# EasyEDA Pro project 闪光徽章.eprj

# Schematic Schematic1

## Sheets
1 LED字符: Board Name: Board1; Create Date: 2025-11-20; Page Name: LED字符; Project Name: 闪光徽章; Schematic Name: Schematic1; Update Date: 2025-11-20; Company: 嘉立创EDA; Page Size: A4; Version: V1.0
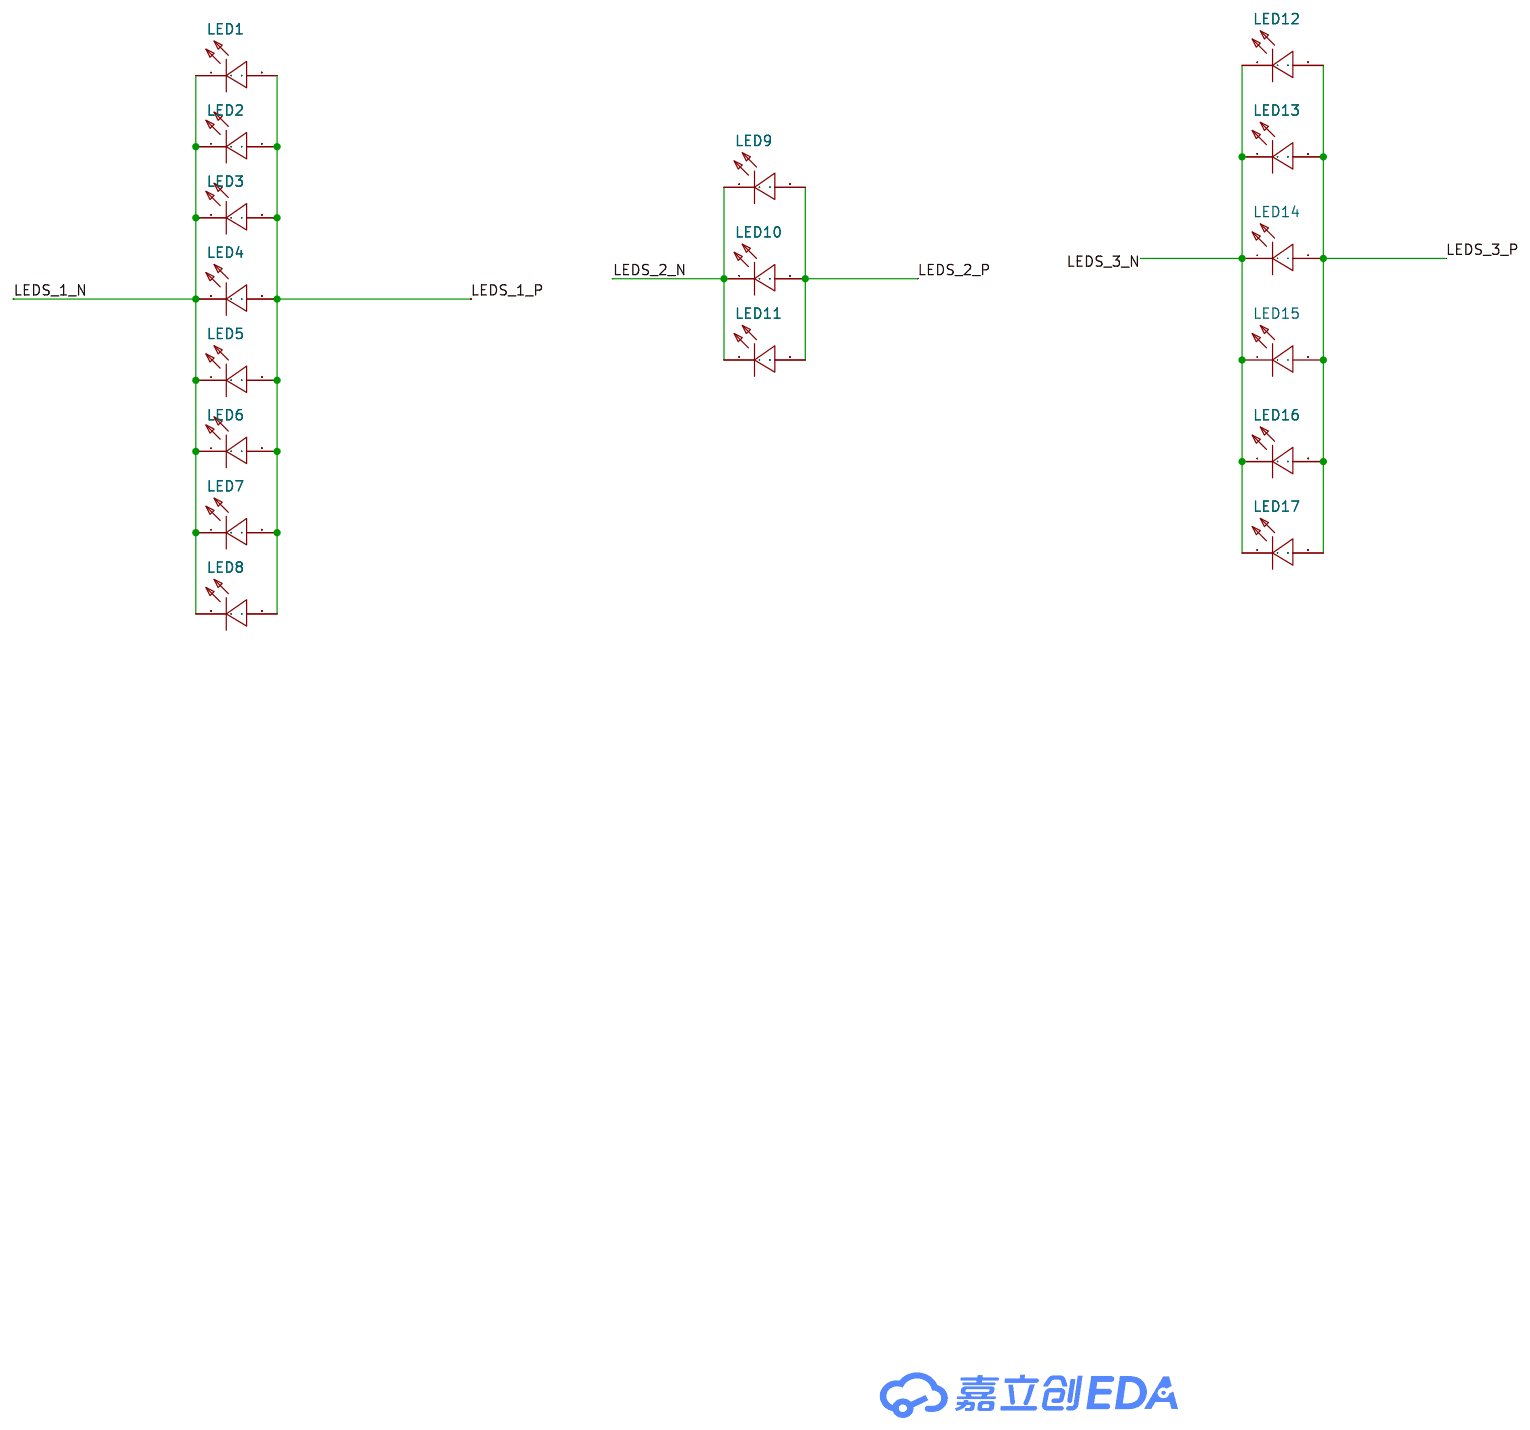
[diagram p0: LED字符]
2 三无稳振荡: Page Name: 三无稳振荡
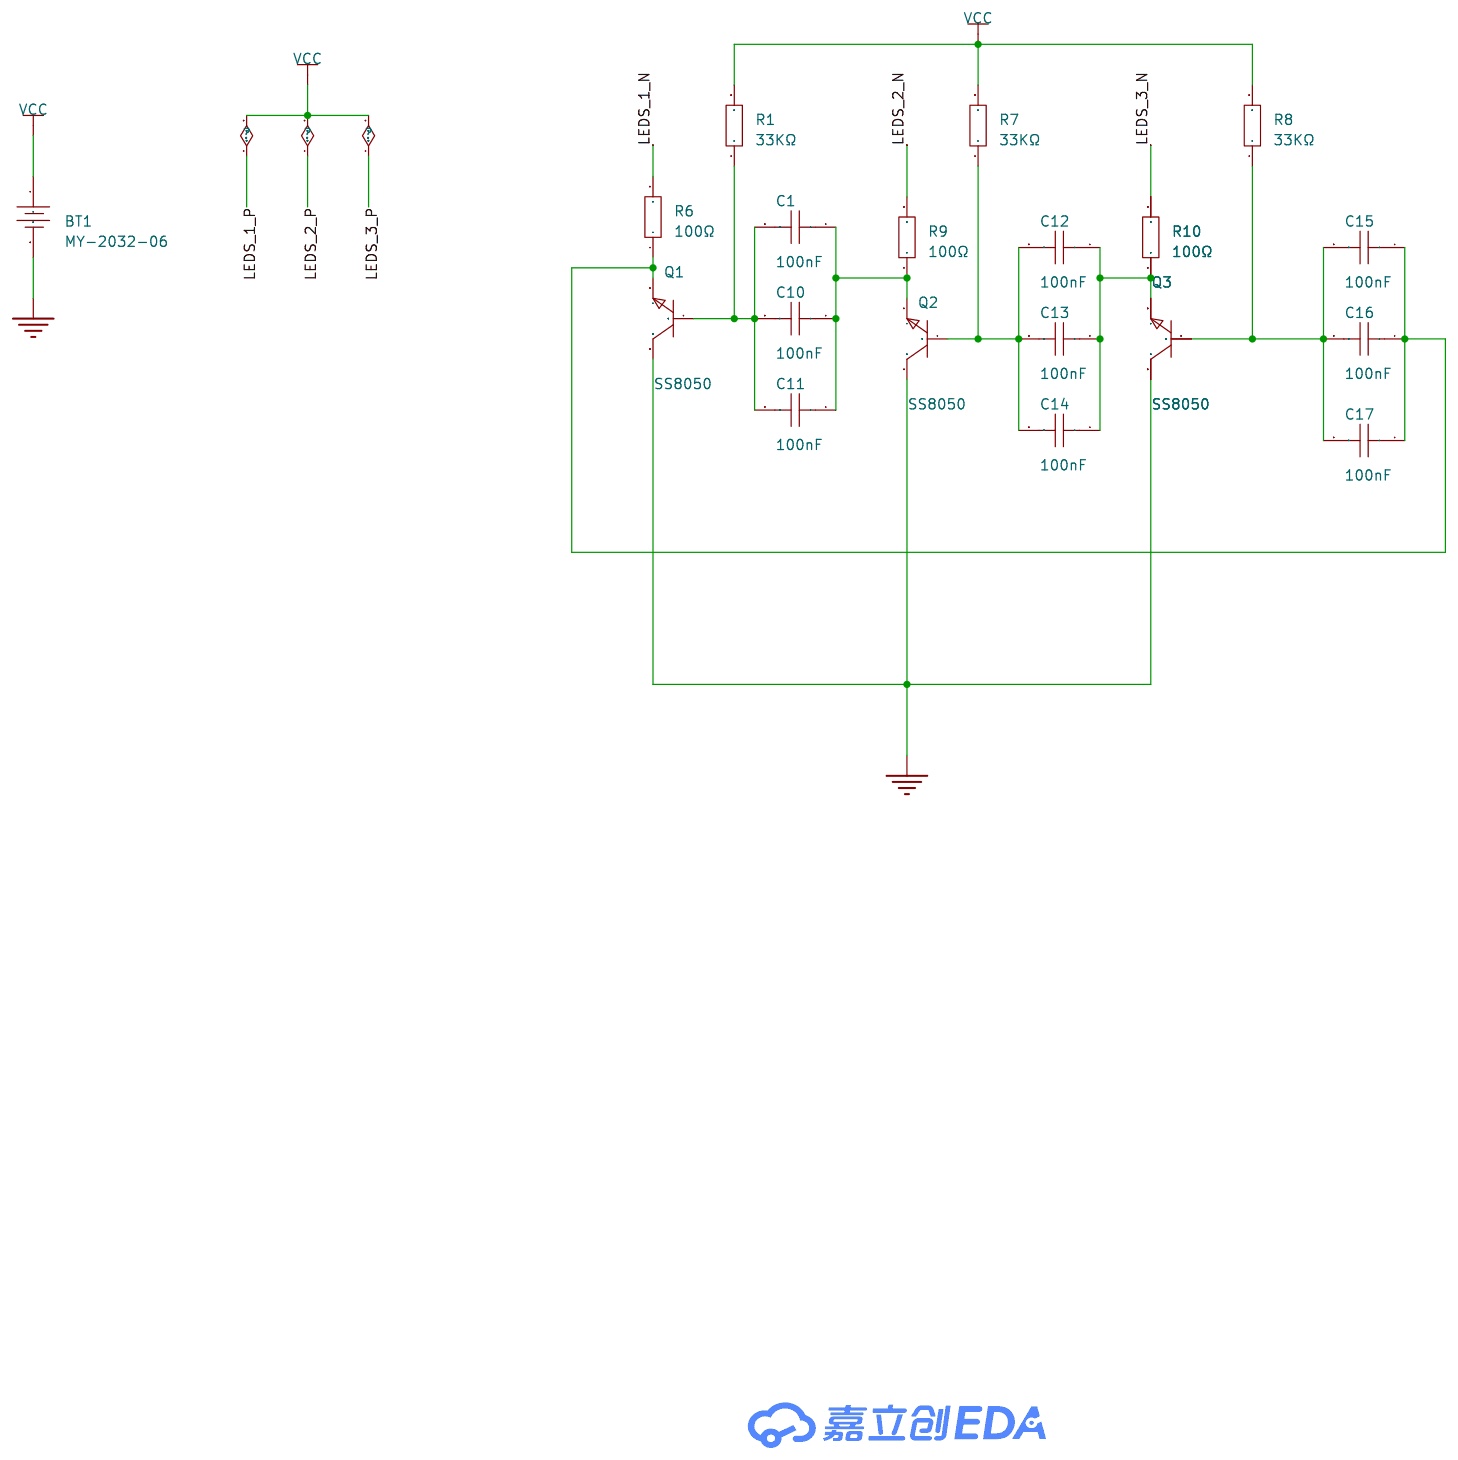
[diagram p1: 三无稳振荡]

## Parts
sheet LED字符
LED1  NCD0603Y2  [LED0603-FD_IN-S63AS5Y]
LED2  NCD0603Y2  [LED0603-FD_IN-S63AS5Y]
LED3  NCD0603Y2  [LED0603-FD_IN-S63AS5Y]
LED4  NCD0603Y2  [LED0603-FD_IN-S63AS5Y]
LED5  NCD0603Y2  [LED0603-FD_IN-S63AS5Y]
LED6  NCD0603Y2  [LED0603-FD_IN-S63AS5Y]
LED7  NCD0603Y2  [LED0603-FD_IN-S63AS5Y]
LED8  NCD0603Y2  [LED0603-FD_IN-S63AS5Y]
LED9  NCD0603Y2  [LED0603-FD_IN-S63AS5Y]
LED10  NCD0603Y2  [LED0603-FD_IN-S63AS5Y]
LED11  NCD0603Y2  [LED0603-FD_IN-S63AS5Y]
LED12  NCD0603Y2  [LED0603-FD_IN-S63AS5Y]
LED13  NCD0603Y2  [LED0603-FD_IN-S63AS5Y]
LED14  NCD0603Y2  [LED0603-FD_IN-S63AS5Y]
LED15  NCD0603Y2  [LED0603-FD_IN-S63AS5Y]
LED16  NCD0603Y2  [LED0603-FD_IN-S63AS5Y]
LED17  NCD0603Y2  [LED0603-FD_IN-S63AS5Y]
sheet 三无稳振荡
BT1  MY-2032-06  [BAT-TH_MY-2032-06]
C1  100nF  [C0603]
C10  100nF  [C0603]
C11  100nF  [C0603]
C12  100nF  [C0603]
C13  100nF  [C0603]
C14  100nF  [C0603]
C15  100nF  [C0603]
C16  100nF  [C0603]
C17  100nF  [C0603]
Q1  SS8050  [SOT-23_L2.9-W1.3-P1.90-LS2.4-BR]
Q2  SS8050  [SOT-23_L2.9-W1.3-P1.90-LS2.4-BR]
Q3  SS8050  [SOT-23_L2.9-W1.3-P1.90-LS2.4-BR]
R1  33KΩ  [R0603]
R6  100Ω  [R0603]
R7  33KΩ  [R0603]
R8  33KΩ  [R0603]
R9  100Ω  [R0603]
R10  100Ω  [R0603]

## Library data of the parts
LED1-LED17 = NCD0603Y2: Supplier Part: C89811; Manufacturer: 国星光电; Supplier Footprint: 0603; JLCPCB Part Class: Extended Part; Datasheet: https://atta.szlcsc.com/upload/public/pdf/source/20200820/C89811_7FE84B429B6BCA3E113B125EE1452576.pdf; Supplier: LCSC; Emitted Color: 黄色; Forward Voltage (VF): 1.6V~2.6V; Power Dissipation: 65mW; Forward Current: 20mA; Dominant Wavelength: 586nm~595nm; Lens Color: 无色透明透镜; Luminous Intensity: 100mcd~220mcd; Viewing Angle: 130°; Operating Temperature: -30℃~+85℃
BT1 = MY-2032-06: LCSC Part Name: 电池扣 适用电池:CR2032; Supplier Part: C964823; Manufacturer: MYOUNG(美阳); Supplier Footprint: 插件; JLCPCB Part Class: Extended Part; Datasheet: https://item.szlcsc.com/datasheet/MY-2032-06/1049789.html; Supplier: LCSC; Connector Type: 电池扣; Battery Type: CR2032; Contact Material: 磷青铜; Contact Plating: 镍
C1 C10-C17 = CL10A105KB8NNNC: LCSC Part Name: 1uF ±10% 50V; Supplier Part: C15849; Manufacturer: SAMSUNG(三星); Supplier Footprint: 0603; JLCPCB Part Class: Basic Part; Datasheet: https://item.szlcsc.com/datasheet/CL10A105KB8NNNC/16531.html; Supplier: LCSC; Tolerance: ±10%; Voltage Rating: 50V; Temperature Coefficient: X5R
Q1-Q3 = SS8050_C431710: LCSC Part Name: NPN 电流:1.5A 耐压:25V (200-350); Supplier Part: C431710; Manufacturer: MDD(辰达半导体); Supplier Footprint: SOT-23; JLCPCB Part Class: Extended Part; Datasheet: https://atta.szlcsc.com/upload/public/pdf/source/20240710/2275D45831FEB988B7478BE0F5F4041C.pdf; Supplier: LCSC; Transistor Type: NPN; Collector Current (Ic): 1.5A; Collector-Emitter Breakdown Voltage (Vceo): 25V; Power Dissipation (Pd): 300mW; DC Current Gain (hFE@Ic,Vce): 120@100mA,1V; Transition Frequency (fT): 100MHz; Collector Cut-Off Current (Icbo): 100nA; Collector-Emitter Saturation Voltage (VCE(sat)@Ic,Ib): 500mV@800mA,80mA; Operating Temperature: -55℃~+150℃
R1 R6-R10 = 0603WAF1001T5E: LCSC Part Name: 1kΩ ±1% 100mW 厚膜电阻; Supplier Part: C21190; Manufacturer: UNI-ROYAL(厚声); Supplier Footprint: 0603; JLCPCB Part Class: Basic Part; Datasheet: https://item.szlcsc.com/datasheet/0603WAF1001T5E/21904.html; Supplier: LCSC; Type: 厚膜电阻; Tolerance: ±1%; Power(Watts): 100mW; Voltage-Supply(Max): 75V; Temperature Coefficient: ±100ppm/℃; Operating Temperature: -55℃~+155℃

## Nets
GND: BT1.2 Q1.3(C) Q2.3(C) Q3.3(C)
VCC: BT1.1 LED1.2(A) LED2.2(A) LED3.2(A) LED4.2(A) LED5.2(A) LED6.2(A) LED7.2(A) LED8.2(A) LED9.2(A) LED10.2(A) LED11.2(A) LED12.2(A) LED13.2(A) LED14.2(A) LED15.2(A) LED16.2(A) LED17.2(A) R1.2 R7.2 R8.2
LEDS_1_N: LED1.1(K) LED2.1(K) LED3.1(K) LED4.1(K) LED5.1(K) LED6.1(K) LED7.1(K) LED8.1(K) R6.2
LEDS_2_N: LED9.1(K) LED10.1(K) LED11.1(K) R9.2
LEDS_3_N: LED12.1(K) LED13.1(K) LED14.1(K) LED15.1(K) LED16.1(K) LED17.1(K) R10.2
$2N1819: C1.1 C10.1 C11.1 Q2.2(E) R9.1
$2N1825: C1.2 C10.2 C11.2 Q1.1(B) R1.1
$2N1865: C12.2 C13.2 C14.2 Q2.1(B) R7.1
$2N1871: C12.1 C13.1 C14.1 Q3.2(E) R10.1
$2N1946: C15.2 C16.2 C17.2 Q3.1(B) R8.1
$2N2743: C15.1 C16.1 C17.1 Q1.2(E) R6.1

# Board PCB1
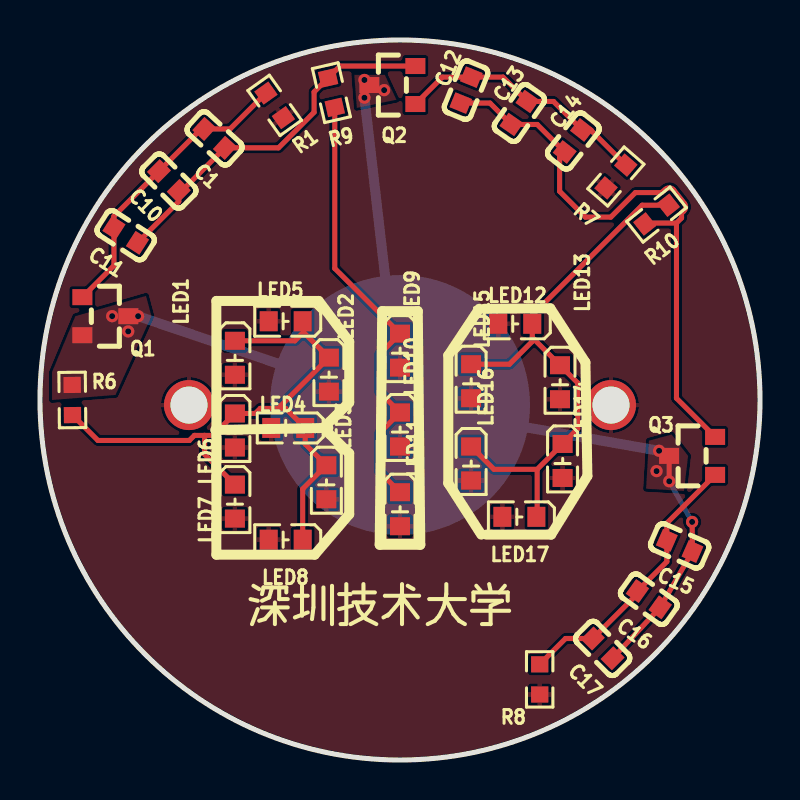
[diagram p2: board, top side]
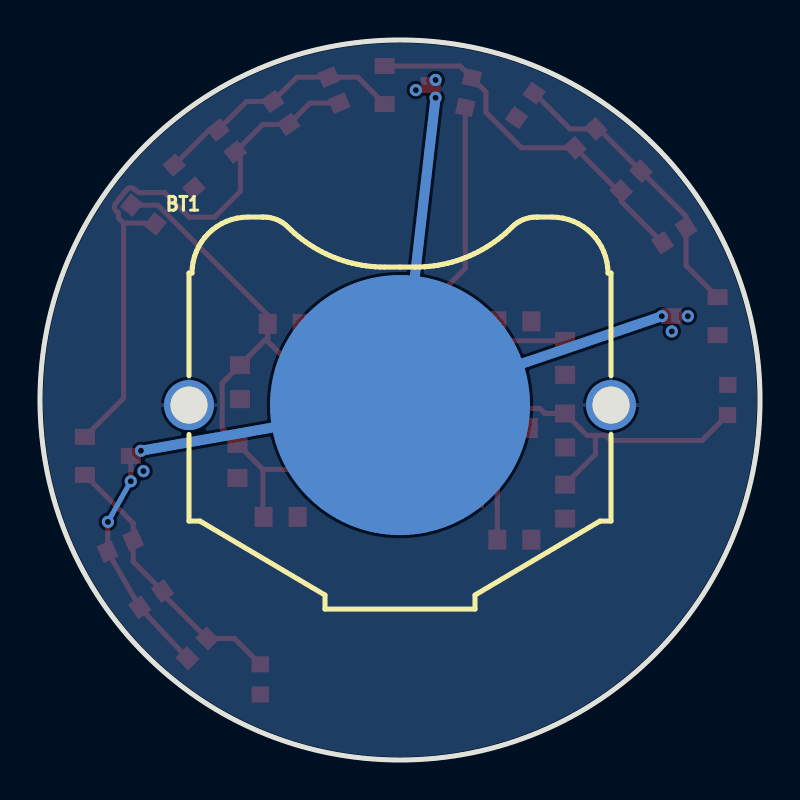
[diagram p3: board, bottom side, seen from below]

Outline 36 x 36 mm; copper layers: Top Layer, Bottom Layer. Coordinates in mm from the lower left corner of the outline.
Outline path: circle c18,18 r18
Stack: Top Layer 0.035mm / Dielectric1 1.51mm FR4 er 4.5 / Bottom Layer 0.035mm

## Design rules (mm)
template: JLCPCB Capability(Two Layers Board)
spacing copperThickness1oz (default): track to track 0.102, other pairs 0.152 to 0.3
spacing copperThickness2oz: track to track 0.203, other pairs 0.152 to 0.3
track width copperThickness1oz (default): min 0.127, default 0.254, max 2.54
track width copperThickness2oz: min 0.203, default 0.254, max 2.54
differential pair differentialPair (default): width min 0.127, default 0.254, max 2.54; gap min 0.152, default 0.152
via viaSize (default): diameter min 0.5, default 0.61, max 10; hole min 0.3, default 0.305, max 6.3

## Placement (name value [footprint] x y rotation side)
BT1  MY-2032-06  [BAT-TH_MY-2032-06]  18 17.75 180 bottom
C1  100nF  [C0603]  8.73 31.08 137.5 top
C10  100nF  [C0603]  6.44 28.95 135 top
C11  100nF  [C0603]  4.28 26.24 147.2 top
C12  100nF  [C0603]  21.3 33.49 67.9 top
C13  100nF  [C0603]  23.97 32.35 55.1 top
C14  100nF  [C0603]  26.67 30.95 51.8 top
C15  100nF  [C0603]  31.98 10.71 156.3 top
C16  100nF  [C0603]  30.44 8.04 144.4 top
C17  100nF  [C0603]  28.13 5.58 135 top
LED1  NCD0603Y2  [LED0603-FD_IN-S63AS5Y]  9.75 20.11 270 top
LED2  NCD0603Y2  [LED0603-FD_IN-S63AS5Y]  14.44 19.27 270 top
LED3  NCD0603Y2  [LED0603-FD_IN-S63AS5Y]  14.32 13.89 270 top
LED4  NCD0603Y2  [LED0603-FD_IN-S63AS5Y]  12.41 16.6 180 top
LED5  NCD0603Y2  [LED0603-FD_IN-S63AS5Y]  12.28 21.94 180 top
LED6  NCD0603Y2  [LED0603-FD_IN-S63AS5Y]  9.75 16.48 270 top
LED7  NCD0603Y2  [LED0603-FD_IN-S63AS5Y]  9.75 12.92 270 top
LED8  NCD0603Y2  [LED0603-FD_IN-S63AS5Y]  12.28 11.02 180 top
LED9  NCD0603Y2  [LED0603-FD_IN-S63AS5Y]  18 20.47 270 top
LED10  NCD0603Y2  [LED0603-FD_IN-S63AS5Y]  18 16.52 270 top
LED11  NCD0603Y2  [LED0603-FD_IN-S63AS5Y]  18 12.54 270 top
LED12  NCD0603Y2  [LED0603-FD_IN-S63AS5Y]  23.76 21.81 180 top
LED13  NCD0603Y2  [LED0603-FD_IN-S63AS5Y]  26 18.89 270 top
LED14  NCD0603Y2  [LED0603-FD_IN-S63AS5Y]  26.13 14.95 270 top
LED15  NCD0603Y2  [LED0603-FD_IN-S63AS5Y]  21.56 18.94 270 top
LED16  NCD0603Y2  [LED0603-FD_IN-S63AS5Y]  21.56 14.82 270 top
LED17  NCD0603Y2  [LED0603-FD_IN-S63AS5Y]  23.97 12.16 180 top
Q1  SS8050  [SOT-23_L2.9-W1.3-P1.90-LS2.4-BR]  3.27 22.19 180 top
Q2  SS8050  [SOT-23_L2.9-W1.3-P1.90-LS2.4-BR]  17.62 33.75 0 top
Q3  SS8050  [SOT-23_L2.9-W1.3-P1.90-LS2.4-BR]  32.6 15.21 0 top
R1  33KΩ  [R0603]  11.73 32.73 305.5 top
R6  100Ω  [R0603]  1.62 18 270.6 top
R7  33KΩ  [R0603]  28.79 29.18 229 top
R8  33KΩ  [R0603]  24.99 4.03 270 top
R9  100Ω  [R0603]  14.57 33.37 282.8 top
R10  100Ω  [R0603]  30.83 27.27 38.5 top

## Footprints (pads in the part's own frame, mm; a bottom-side part is the same pattern mirrored in y, then rotated)
BAT-TH_MY-2032-06
  round 2.5 hole 1.85: 1(-10.55,0) 1(10.55,0)
  round 13 smd: 2(0,0)
C0603
  rect 0.8x0.9 smd: 1(-0.7,0) 2(0.7,0)
LED0603-FD_IN-S63AS5Y
  rect 0.9x1 smd: 1(-0.85,0) 2(0.85,0)
R0603
  rect 0.806x0.864 smd: 1(-0.753,0) 2(0.753,0)
SOT-23_L2.9-W1.3-P1.90-LS2.4-BR
  rect 1x0.8 smd: 1(1.15,-0.95) 2(1.15,0.95) 3(-1.15,0)

## Nets
GND: BT1.2 C15.1 C16.1 C17.1 Q1.2 Q1.3 Q2.3 Q3.3 R6.1
VCC: BT1.1 LED1.2 LED2.2 LED3.2 LED4.2 LED5.2 LED6.2 LED7.2 LED8.2 LED9.2 LED10.2 LED11.2 LED12.2 LED13.2 LED14.2 LED15.2 LED16.2 LED17.2 R1.2 R7.2 R8.2
LEDS_1_N: LED1.1 LED2.1 LED3.1 LED4.1 LED5.1 LED6.1 LED7.1 LED8.1 R6.2
LEDS_2_N: LED9.1 LED10.1 LED11.1 R9.2
LEDS_3_N: LED12.1 LED13.1 LED14.1 LED15.1 LED16.1 LED17.1 R10.2
$2N1819: C1.1 C10.1 C11.1 Q2.2 R9.1
$2N1825: C1.2 C10.2 C11.2 Q1.1 R1.1
$2N1865: C12.2 C13.2 C14.2 Q2.1 R7.1
$2N1871: C12.1 C13.1 C14.1 Q3.2 R10.1
$2N1946: C15.2 C16.2 C17.2 Q3.1 R8.1

## Via types
v1: diameter 0.61, hole 0.305, Top Layer to Bottom Layer, 10 vias

## Routing (per net, layer and track width the routed paths; a pad name or vN(x,y) marks a point on that pad's centre or on a via; arc(x,y) is an arc through that point)
GND: length 54.2
  Top Layer w0.254: C17.1 31.01,7.63 C15.1 v1(32.6,11.9) ; v1(31.46,13.94) 31.46,15.21
  Bottom Layer w0.254: v1(32.6,11.9) v1(31.46,13.94)
  Bottom Layer w0.5: v1(30.95,15.46) BT1.2 ; BT1.2 v1(4.91,22.19) ; BT1.2 v1(16.22,33.11)
  vias: v1(3.61,22.19) v1(4.41,21.43) v1(16.22,34) v1(17.21,33.49) v1(30.83,14.44)
LEDS_1_N: length 32.3
  Top Layer w0.254: LED5.1 13.17,21.9 13.17,21.39 ; 13.17,21.39 LED2.1 12.03,17.71 12.03,17.58 ; 13.17,21.39 12.74,20.96 LED1.1 ; 8.23,16.23 8.23,15.29 LED7.1 ; 8.23,16.23 7.72,16.23 7.47,15.98 2.89,15.98 R6.2 ; 8.23,16.23 8.65,16.23 LED6.1 10.76,17.33 11.01,17.58 12.03,17.58 ; 12.03,17.58 12.28,17.58 LED4.1 13.26,15.79 LED3.1 13.13,13.55 LED8.1
LEDS_2_N: length 22.3
  Top Layer w0.254: LED11.1 16.98,14.41 16.98,16.36 LED10.1 16.98,18.39 16.98,20.3 LED9.1 14.74,24.58 R9.2
LEDS_3_N: length 28.5
  Top Layer w0.254: 24.61,21.13 24.61,20.93 23.47,19.79 LED15.1 ; 24.61,21.13 LED13.1 26.89,18.85 26.89,16.56 LED14.1 24.86,14.53 ; 24.61,21.13 LED12.1 24.61,22.25 30.11,27.74 R10.2 ; LED16.1 22.7,14.53 24.86,14.53 ; 24.86,14.53 24.86,12.2 LED17.1
$2N1819: length 18.5
  Top Layer w0.254: C11.1 6.94,27.93 C10.1 7.09,28.45 C1.1 11.93,30.61 13.7,32.39 13.7,33.4 R9.1 15,34.7 Q2.2
$2N1825: length 14.9
  Top Layer w0.254: Q1.1 3.7,24.72 C11.2 3.7,27.19 C10.2 8.06,31.55 C1.2 9.5,31.55 R1.1
$2N1865: length 12.9
  Top Layer w0.254: Q2.1 20.11,34.14 C12.2 23.15,34.14 24.37,32.93 25.68,32.93 27.1,31.5 27.53,31.5 R7.1
$2N1871: length 30.3
  Top Layer w0.254: 31.82,26.85 32.08,27.1 32.08,27.36 32.18,27.43 arc(32.28,27.62) 32.22,27.83 31.68,28.5 arc(31.5,28.61) 31.29,28.55 31.07,28.37 29.77,28.37 28.54,27.14 27.27,27.14 25.98,28.43 25.98,30.15 26.24,30.4 24.86,31.78 C13.1 22.5,32.85 C12.1 ; 31.82,26.85 30.28,26.85 30.24,26.8 ; 31.82,26.85 31.82,18.09 Q3.2
$2N1946: length 13.9
  Top Layer w0.254: R8.1 26.28,6.07 C17.2 29.87,8.31 C16.2 31.34,9.92 31.34,11.84 Q3.1

## Copper pours and planes (outline as drawn; the poured copper is in the pictures)
GND on Top Layer: 30.3,16.27 32.41,16.27 32.41,13.45 30.3,13.45
GND on Top Layer: 0.6,23.21 5.57,23.21 5.57,18 0.6,18
GND on Top Layer: 15.71,34.26 17.82,34.26 17.82,32.6 15.71,32.6
VCC on Top Layer: -5.11,37.56 48.23,37.56 48.23,-4.23 -5.11,-4.23
VCC on Top Layer: -5.11,37.56 48.23,37.56 48.23,-3.97 -5.11,-3.97
VCC on Top Layer: -8.16,39.72 47.59,39.72 47.59,-1.18 -8.16,-1.18
VCC on Bottom Layer: -6.89,38.7 51.53,38.7 51.53,-4.35 -6.89,-4.35

## Text on the board
Top Silkscreen Layer: 深圳技术大学

# Board PCB2
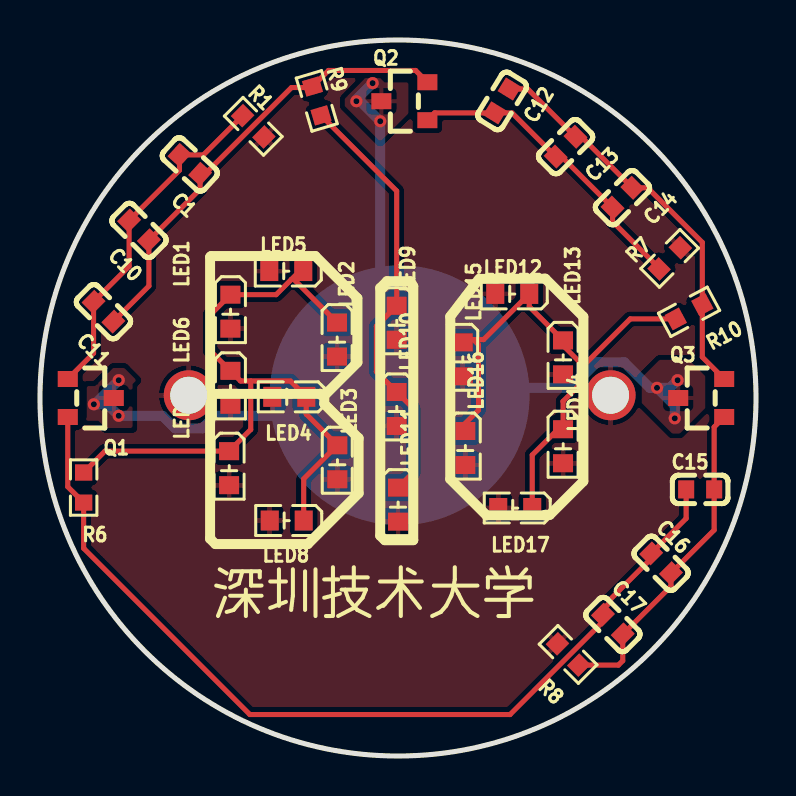
[diagram p4: board, top side]
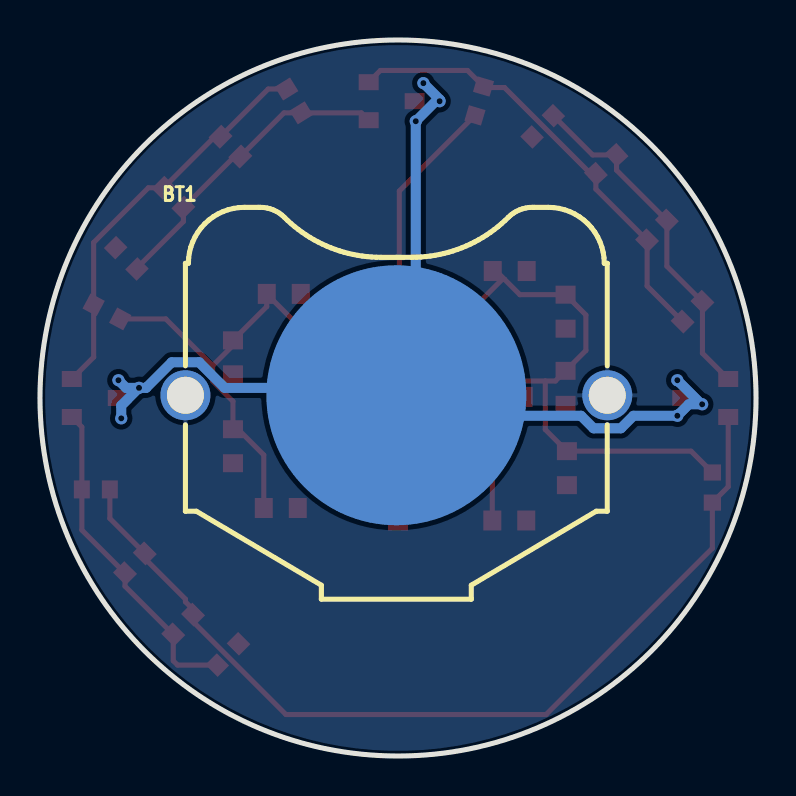
[diagram p5: board, bottom side, seen from below]

Outline 35.81 x 35.81 mm; copper layers: Top Layer, Bottom Layer. Coordinates in mm from the lower left corner of the outline.
Outline path: circle c17.91,17.91 r17.91
Stack: Top Layer 0.035mm / Dielectric1 1.51mm FR4 er 4.5 / Bottom Layer 0.035mm

## Design rules (mm)
template: JLCPCB Capability(Two Layers Board)
spacing copperThickness1oz (default): track to track 0.102, other pairs 0.152 to 0.3
spacing copperThickness2oz: track to track 0.203, other pairs 0.152 to 0.3
track width copperThickness1oz (default): min 0.127, default 0.254, max 2.54
track width copperThickness2oz: min 0.203, default 0.254, max 2.54
differential pair differentialPair (default): width min 0.127, default 0.254, max 2.54; gap min 0.152, default 0.152
via viaSize (default): diameter min 0.5, default 0.61, max 10; hole min 0.3, default 0.305, max 6.3

## Placement (name value [footprint] x y rotation side)
BT1  MY-2032-06  [BAT-TH_MY-2032-06]  17.99 18.04 180 bottom
C1  100nF  [C0603]  7.49 29.59 137.6 top
C10  100nF  [C0603]  4.95 26.29 135 top
C11  100nF  [C0603]  3.18 22.23 135 top
C12  100nF  [C0603]  23.11 32.77 238.4 top
C13  100nF  [C0603]  26.29 30.48 225 top
C14  100nF  [C0603]  29.14 27.93 225 top
C15  100nF  [C0603]  33.02 13.34 0 top
C16  100nF  [C0603]  31.07 9.64 315 top
C17  100nF  [C0603]  28.65 6.58 315 top
LED1  NCD0603Y2  [LED0603-FD_IN-S63AS5Y]  9.53 22.23 270 top
LED2  NCD0603Y2  [LED0603-FD_IN-S63AS5Y]  14.86 20.83 270 top
LED3  NCD0603Y2  [LED0603-FD_IN-S63AS5Y]  14.87 14.69 270 top
LED4  NCD0603Y2  [LED0603-FD_IN-S63AS5Y]  12.47 17.97 180 top
LED5  NCD0603Y2  [LED0603-FD_IN-S63AS5Y]  12.32 24.26 180 top
LED6  NCD0603Y2  [LED0603-FD_IN-S63AS5Y]  9.53 18.42 270 top
LED7  NCD0603Y2  [LED0603-FD_IN-S63AS5Y]  9.46 14.4 270 top
LED8  NCD0603Y2  [LED0603-FD_IN-S63AS5Y]  12.34 11.78 180 top
LED9  NCD0603Y2  [LED0603-FD_IN-S63AS5Y]  17.84 21.67 270 top
LED10  NCD0603Y2  [LED0603-FD_IN-S63AS5Y]  17.84 17.36 270 top
LED11  NCD0603Y2  [LED0603-FD_IN-S63AS5Y]  17.91 12.57 270 top
LED12  NCD0603Y2  [LED0603-FD_IN-S63AS5Y]  23.62 23.11 180 top
LED13  NCD0603Y2  [LED0603-FD_IN-S63AS5Y]  26.16 19.94 270 top
LED14  NCD0603Y2  [LED0603-FD_IN-S63AS5Y]  26.16 15.49 270 top
LED15  NCD0603Y2  [LED0603-FD_IN-S63AS5Y]  21.14 19.84 270 top
LED16  NCD0603Y2  [LED0603-FD_IN-S63AS5Y]  21.27 15.41 270 top
LED17  NCD0603Y2  [LED0603-FD_IN-S63AS5Y]  23.77 12.41 180 top
Q1  SS8050  [SOT-23_L2.9-W1.3-P1.90-LS2.4-BR]  2.54 17.91 180 top
Q2  SS8050  [SOT-23_L2.9-W1.3-P1.90-LS2.4-BR]  18.22 32.75 0 top
Q3  SS8050  [SOT-23_L2.9-W1.3-P1.90-LS2.4-BR]  33.07 17.91 0 top
R1  33KΩ  [R0603]  10.67 31.5 315 top
R6  100Ω  [R0603]  2.18 13.43 90 top
R7  33KΩ  [R0603]  31.5 24.89 45 top
R8  33KΩ  [R0603]  26.42 5.08 135 top
R9  100Ω  [R0603]  13.84 32.77 286.5 top
R10  100Ω  [R0603]  32.46 22.22 208.2 top

## Footprints (pads in the part's own frame, mm; a bottom-side part is the same pattern mirrored in y, then rotated)
BAT-TH_MY-2032-06
  round 2.5 hole 1.85: 1(-10.55,0) 1(10.55,0)
  round 13 smd: 2(0,0)
C0603
  rect 0.8x0.9 smd: 1(-0.7,0) 2(0.7,0)
LED0603-FD_IN-S63AS5Y
  rect 0.9x1 smd: 1(-0.85,0) 2(0.85,0)
R0603
  rect 0.806x0.864 smd: 1(-0.753,0) 2(0.753,0)
SOT-23_L2.9-W1.3-P1.90-LS2.4-BR
  rect 1x0.8 smd: 1(1.15,-0.95) 2(1.15,0.95) 3(-1.15,0)

## Nets
As in the schematic.

## Via types
v1: diameter 0.61, hole 0.305, Top Layer to Bottom Layer, 9 vias

## Routing (per net, layer and track width the routed paths; a pad name or vN(x,y) marks a point on that pad's centre or on a via; arc(x,y) is an arc through that point)
GND: length 52.3
  Bottom Layer w0.5: v1(3.94,18.8) 2.73,17.59 ; 2.73,17.59 3.36,17.59 v1(3.94,17.02) 6.13,17.02 6.76,16.39 8.12,16.39 8.75,17.02 16.96,17.02 BT1.2 ; 2.73,17.59 v1(2.69,17.59) ; v1(30.86,18.42) 30.5,18.42 29.22,19.7 27.86,19.7 26.58,18.42 18.36,18.42 BT1.2 ; v1(30.86,18.42) 31.51,18.42 v1(31.89,18.8) ; v1(30.86,18.42) 31.75,17.53 v1(31.75,16.89) ; BT1.2 17.02,19.02 v1(17.02,31.75) 16.02,32.75 v1(15.83,32.75) 15.83,32.84 v1(16.64,33.66)
LEDS_1_N: length 35.5
  Top Layer w0.254: 10.54,18.76 12.53,18.76 LED4.1 13.32,17.1 LED3.1 13.19,13.86 LED8.1 ; 10.54,18.76 10.54,16.33 LED7.1 3.25,15.25 R6.2 ; 10.54,18.76 10.03,18.76 LED6.1 8.51,20.28 8.51,22.06 LED1.1 11.81,23.08 12.57,23.84 ; 12.57,23.84 12.7,23.84 LED2.1 ; 12.57,23.84 12.99,24.26 LED5.1
LEDS_2_N: length 21.7
  Top Layer w0.254: R9.2 17.84,28.26 LED9.1 16.83,21.5 16.83,19.23 LED10.1 18.67,17.38 18.67,14.19 LED11.1
LEDS_3_N: length 27.8
  Top Layer w0.254: 27.18,19.52 26.16,20.54 LED13.1 24.47,22.48 LED12.1 22.19,20.83 21.68,20.83 ; 27.18,19.52 27.18,18.76 26.16,17.74 26.16,16.6 24.62,15.06 LED17.1 ; 27.18,19.52 29.52,21.86 R10.2 ; LED15.1 21.28,20.83 21.68,20.83 ; 21.68,20.83 21.93,20.57 21.93,17.3 21.27,16.64 LED16.1
$2N1819: length 22.9
  Top Layer w0.254: C11.1 5.45,23.51 C10.1 8.01,28.36 C1.1 8.26,29.12 12.58,33.44 13.58,33.44 13.63,33.49 14.43,34.29 18.79,34.29 Q2.2
$2N1825: length 17.5
  Top Layer w0.254: Q1.1 2.68,20.15 C11.2 4.46,24.5 C10.2 6.98,29.3 C1.2 8.17,30.06 R1.1
$2N1865: length 15.5
  Top Layer w0.254: 31.09,24.49 30.89,24.49 28.64,26.73 28.64,27.43 26.09,29.99 C13.2 23.61,32.17 C12.2 19.74,32.17 Q2.1
$2N1871: length 20.1
  Top Layer w0.254: Q3.2 33.13,19.95 R10.1 33.13,25.69 30.39,28.42 29.63,28.42 27.08,30.98 C13.1 24.4,33.36 23.48,33.36
$2N1946: length 16.6
  Top Layer w0.254: Q3.1 33.72,16.45 C15.2 33.72,11.3 31.56,9.14 31.56,8.49 C17.2 29.15,4.76 28.93,4.55 R8.1
$2N2743: length 46.8
  Top Layer w0.254: Q1.2 1.39,13.47 R6.1 2.18,10.39 10.5,2.07 23.51,2.07 28.29,6.85 28.29,7.2 ; C15.1 32.32,11.88 30.44,10.01 30.44,9.75 28.54,7.85 28.54,7.71 28.29,7.46 28.29,7.2 ; 28.29,7.2 C17.1

## Copper pours and planes (outline as drawn; the poured copper is in the pictures)
GND on Top Layer: 16.18,33.82 15.24,32.88 15.24,32.51 17.02,30.73 18.43,32.14 18.43,33.69 17.23,33.69 16.89,34.04 16.38,34.04 16.18,33.84
GND on Top Layer: 30.1,17.65 31.62,16.13 32,16.13 33.27,17.4 33.27,19.01 32.47,19.81 30.99,19.81 30.1,18.92
GND on Top Layer: 3.66,19.41 2.75,18.5 2.34,18.5 2.34,16.94 2.16,16.76 2.92,16.76 3.28,16.41 4.63,16.41 4.63,18.6 4.83,18.8 4.22,19.41
VCC on Top Layer: -0.89,44.32 43.18,44.32 43.18,-4.83 -0.89,-4.83
VCC on Top Layer: -0.63,37.34 39.75,37.34 39.75,-1.4 -0.63,-1.4
VCC on Top Layer: -8.76,47.24 57.28,47.24 57.28,-17.53 -8.76,-17.53
VCC on Top Layer: -5.21,40.13 46.1,40.13 46.1,-7.49 -5.21,-7.49
VCC on Top Layer: -9.78,46.74 49.02,46.74 49.02,-16 -9.78,-16
VCC on Top Layer: -1.78,36.32 38.23,36.32 38.23,-4.06 -1.78,-4.06
VCC on Bottom Layer: -3.68,38.48 41.4,38.48 41.4,-4.7 -3.68,-4.7
VCC on Bottom Layer: -4.44,41.15 47.24,41.15 47.24,-5.08 -4.44,-5.08

## Text on the board
Top Silkscreen Layer: 深圳技术大学

# Board PCB1_1
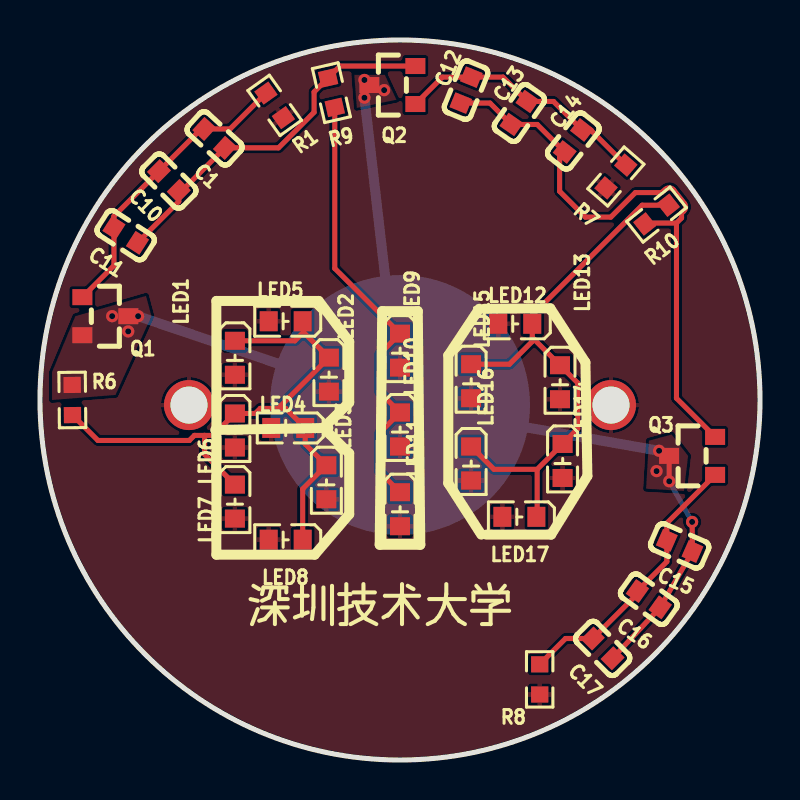
[diagram p6: board, top side]
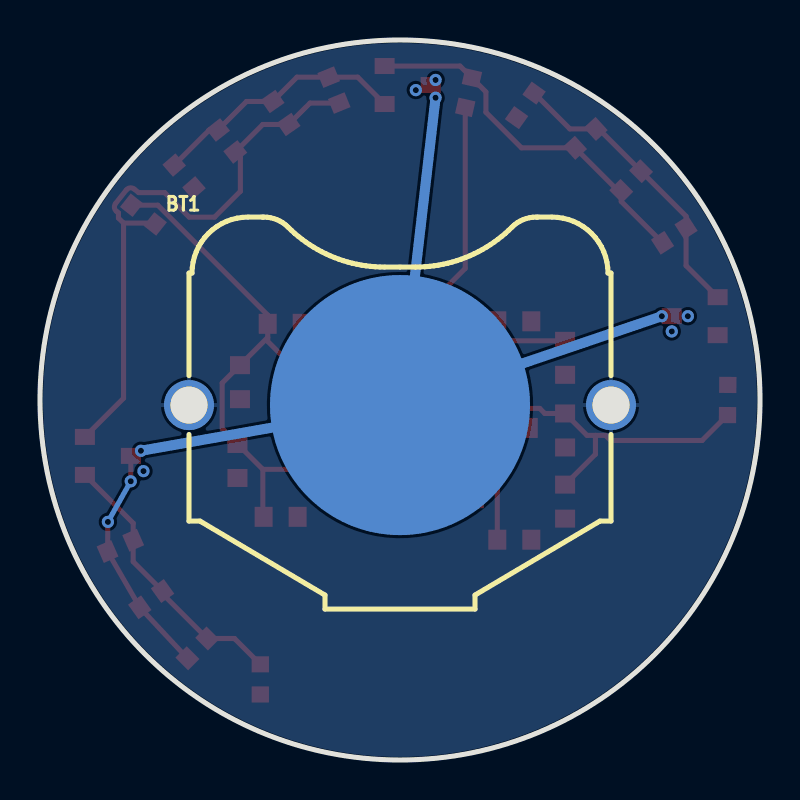
[diagram p7: board, bottom side, seen from below]

Outline 36 x 36 mm; copper layers: Top Layer, Bottom Layer. Coordinates in mm from the lower left corner of the outline.
Outline path: circle c18,18 r18
Stack: Top Layer 0.035mm / Dielectric1 1.51mm FR4 er 4.5 / Bottom Layer 0.035mm

## Design rules (mm)
template: JLCPCB Capability(Two Layers Board)
spacing copperThickness1oz (default): track to track 0.102, other pairs 0.152 to 0.3
spacing copperThickness2oz: track to track 0.203, other pairs 0.152 to 0.3
track width copperThickness1oz (default): min 0.127, default 0.254, max 2.54
track width copperThickness2oz: min 0.203, default 0.254, max 2.54
differential pair differentialPair (default): width min 0.127, default 0.254, max 2.54; gap min 0.152, default 0.152
via viaSize (default): diameter min 0.5, default 0.61, max 10; hole min 0.3, default 0.305, max 6.3

## Placement (name value [footprint] x y rotation side)
BT1  MY-2032-06  [BAT-TH_MY-2032-06]  18 17.75 180 bottom
C1  100nF  [C0603]  8.73 31.08 137.5 top
C10  100nF  [C0603]  6.44 28.95 135 top
C11  100nF  [C0603]  4.28 26.24 147.2 top
C12  100nF  [C0603]  21.3 33.49 67.9 top
C13  100nF  [C0603]  23.97 32.35 55.1 top
C14  100nF  [C0603]  26.67 30.95 51.8 top
C15  100nF  [C0603]  31.98 10.71 156.3 top
C16  100nF  [C0603]  30.44 8.04 144.4 top
C17  100nF  [C0603]  28.13 5.58 135 top
LED1  NCD0603Y2  [LED0603-FD_IN-S63AS5Y]  9.75 20.11 270 top
LED2  NCD0603Y2  [LED0603-FD_IN-S63AS5Y]  14.44 19.27 270 top
LED3  NCD0603Y2  [LED0603-FD_IN-S63AS5Y]  14.32 13.89 270 top
LED4  NCD0603Y2  [LED0603-FD_IN-S63AS5Y]  12.41 16.6 180 top
LED5  NCD0603Y2  [LED0603-FD_IN-S63AS5Y]  12.28 21.94 180 top
LED6  NCD0603Y2  [LED0603-FD_IN-S63AS5Y]  9.75 16.48 270 top
LED7  NCD0603Y2  [LED0603-FD_IN-S63AS5Y]  9.75 12.92 270 top
LED8  NCD0603Y2  [LED0603-FD_IN-S63AS5Y]  12.28 11.02 180 top
LED9  NCD0603Y2  [LED0603-FD_IN-S63AS5Y]  18 20.47 270 top
LED10  NCD0603Y2  [LED0603-FD_IN-S63AS5Y]  18 16.52 270 top
LED11  NCD0603Y2  [LED0603-FD_IN-S63AS5Y]  18 12.54 270 top
LED12  NCD0603Y2  [LED0603-FD_IN-S63AS5Y]  23.76 21.81 180 top
LED13  NCD0603Y2  [LED0603-FD_IN-S63AS5Y]  26 18.89 270 top
LED14  NCD0603Y2  [LED0603-FD_IN-S63AS5Y]  26.13 14.95 270 top
LED15  NCD0603Y2  [LED0603-FD_IN-S63AS5Y]  21.56 18.94 270 top
LED16  NCD0603Y2  [LED0603-FD_IN-S63AS5Y]  21.56 14.82 270 top
LED17  NCD0603Y2  [LED0603-FD_IN-S63AS5Y]  23.97 12.16 180 top
Q1  SS8050  [SOT-23_L2.9-W1.3-P1.90-LS2.4-BR]  3.27 22.19 180 top
Q2  SS8050  [SOT-23_L2.9-W1.3-P1.90-LS2.4-BR]  17.62 33.75 0 top
Q3  SS8050  [SOT-23_L2.9-W1.3-P1.90-LS2.4-BR]  32.6 15.21 0 top
R1  33KΩ  [R0603]  11.73 32.73 305.5 top
R6  100Ω  [R0603]  1.62 18 270.6 top
R7  33KΩ  [R0603]  28.79 29.18 229 top
R8  33KΩ  [R0603]  24.99 4.03 270 top
R9  100Ω  [R0603]  14.57 33.37 282.8 top
R10  100Ω  [R0603]  30.83 27.27 38.5 top

## Footprints (pads in the part's own frame, mm; a bottom-side part is the same pattern mirrored in y, then rotated)
BAT-TH_MY-2032-06
  round 2.5 hole 1.85: 1(-10.55,0) 1(10.55,0)
  round 13 smd: 2(0,0)
C0603
  rect 0.8x0.9 smd: 1(-0.7,0) 2(0.7,0)
LED0603-FD_IN-S63AS5Y
  rect 0.9x1 smd: 1(-0.85,0) 2(0.85,0)
R0603
  rect 0.806x0.864 smd: 1(-0.753,0) 2(0.753,0)
SOT-23_L2.9-W1.3-P1.90-LS2.4-BR
  rect 1x0.8 smd: 1(1.15,-0.95) 2(1.15,0.95) 3(-1.15,0)

## Nets
GND: BT1.2 C15.1 C16.1 C17.1 Q1.2 Q1.3 Q2.3 Q3.3 R6.1
VCC: BT1.1 LED1.2 LED2.2 LED3.2 LED4.2 LED5.2 LED6.2 LED7.2 LED8.2 LED9.2 LED10.2 LED11.2 LED12.2 LED13.2 LED14.2 LED15.2 LED16.2 LED17.2 R1.2 R7.2 R8.2
LEDS_1_N: LED1.1 LED2.1 LED3.1 LED4.1 LED5.1 LED6.1 LED7.1 LED8.1 R6.2
LEDS_2_N: LED9.1 LED10.1 LED11.1 R9.2
LEDS_3_N: LED12.1 LED13.1 LED14.1 LED15.1 LED16.1 LED17.1 R10.2
$2N1819: C1.1 C10.1 C11.1 Q2.2 R9.1
$2N1825: C1.2 C10.2 C11.2 Q1.1 R1.1
$2N1865: C12.2 C13.2 C14.2 Q2.1 R7.1
$2N1871: C12.1 C13.1 C14.1 Q3.2 R10.1
$2N1946: C15.2 C16.2 C17.2 Q3.1 R8.1

## Via types
v1: diameter 0.61, hole 0.305, Top Layer to Bottom Layer, 10 vias

## Routing (per net, layer and track width the routed paths; a pad name or vN(x,y) marks a point on that pad's centre or on a via; arc(x,y) is an arc through that point)
GND: length 54.2
  Top Layer w0.254: v1(32.6,11.9) C15.1 31.01,7.63 C17.1 ; v1(31.46,13.94) 31.46,15.21
  Bottom Layer w0.254: v1(32.6,11.9) v1(31.46,13.94)
  Bottom Layer w0.5: v1(4.91,22.19) BT1.2 ; BT1.2 v1(30.95,15.46) ; BT1.2 v1(16.22,33.11)
  vias: v1(3.61,22.19) v1(4.41,21.43) v1(16.22,34) v1(17.21,33.49) v1(30.83,14.44)
LEDS_1_N: length 32.3
  Top Layer w0.254: 13.17,21.39 12.74,20.96 LED1.1 ; 13.17,21.39 LED2.1 12.03,17.71 12.03,17.58 ; 13.17,21.39 13.17,21.9 LED5.1 ; R6.2 2.89,15.98 7.47,15.98 7.72,16.23 8.23,16.23 ; LED7.1 8.23,15.29 8.23,16.23 ; 8.23,16.23 8.65,16.23 LED6.1 10.76,17.33 11.01,17.58 12.03,17.58 ; LED8.1 13.13,13.55 LED3.1 13.26,15.79 LED4.1 12.28,17.58 12.03,17.58
LEDS_2_N: length 22.3
  Top Layer w0.254: LED11.1 16.98,14.41 16.98,16.36 LED10.1 16.98,18.39 16.98,20.3 LED9.1 14.74,24.58 R9.2
LEDS_3_N: length 28.5
  Top Layer w0.254: 24.61,21.13 24.61,20.93 23.47,19.79 LED15.1 ; 24.61,21.13 LED13.1 26.89,18.85 26.89,16.56 LED14.1 24.86,14.53 ; 24.61,21.13 LED12.1 24.61,22.25 30.11,27.74 R10.2 ; 24.86,14.53 24.86,12.2 LED17.1 ; 24.86,14.53 22.7,14.53 LED16.1
$2N1819: length 18.5
  Top Layer w0.254: Q2.2 15,34.7 R9.1 13.7,33.4 13.7,32.39 11.93,30.61 C1.1 7.09,28.45 C10.1 6.94,27.93 C11.1
$2N1825: length 14.9
  Top Layer w0.254: Q1.1 3.7,24.72 C11.2 3.7,27.19 C10.2 8.06,31.55 C1.2 9.5,31.55 R1.1
$2N1865: length 12.9
  Top Layer w0.254: R7.1 27.53,31.5 27.1,31.5 25.68,32.93 24.37,32.93 23.15,34.14 C12.2 20.11,34.14 Q2.1
$2N1871: length 30.3
  Top Layer w0.254: C12.1 22.5,32.85 C13.1 24.86,31.78 26.24,30.4 25.98,30.15 25.98,28.43 27.27,27.14 28.54,27.14 29.77,28.37 31.07,28.37 31.29,28.55 arc(31.5,28.61) 31.68,28.5 32.22,27.83 arc(32.28,27.62) 32.18,27.43 32.08,27.36 32.08,27.1 31.82,26.85 ; 31.82,26.85 31.82,18.09 Q3.2 ; 31.82,26.85 30.28,26.85 30.24,26.8
$2N1946: length 13.9
  Top Layer w0.254: Q3.1 31.34,11.84 31.34,9.92 C16.2 29.87,8.31 C17.2 26.28,6.07 R8.1

## Copper pours and planes (outline as drawn; the poured copper is in the pictures)
GND on Top Layer: 0.6,23.21 5.57,23.21 5.57,18 0.6,18
GND on Top Layer: 15.71,34.26 17.82,34.26 17.82,32.6 15.71,32.6
GND on Top Layer: 30.3,16.27 32.41,16.27 32.41,13.45 30.3,13.45
VCC on Top Layer: -8.16,39.72 47.59,39.72 47.59,-1.18 -8.16,-1.18
VCC on Top Layer: -5.11,37.56 48.23,37.56 48.23,-4.23 -5.11,-4.23
VCC on Top Layer: -5.11,37.56 48.23,37.56 48.23,-3.97 -5.11,-3.97
VCC on Bottom Layer: -6.89,38.7 51.53,38.7 51.53,-4.35 -6.89,-4.35

## Text on the board
Top Silkscreen Layer: 深圳技术大学
